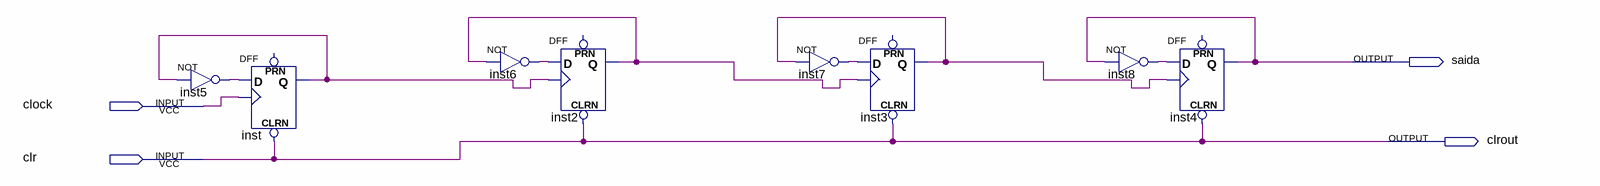
[diagram p0: schematic sheet]
// Quartus schematic flipflopd.bdf as structural Verilog: 8 symbols, 4 pins
module flipflopd (
  input  clock,
  input  clr,
  output saida,
  output clrout
);

  wire inst2_q, inst3_q, inst5_out, inst6_out, inst7_out, inst8_out, inst_q;

  not inst5 (inst5_out, inst_q);
  DFF inst (.CLRN(clr), .CLK(clock), .D(inst5_out), .Q(inst_q));  // open: PRN
  not inst6 (inst6_out, inst2_q);
  DFF inst2 (.CLRN(clr), .CLK(inst_q), .D(inst6_out), .Q(inst2_q));  // open: PRN
  not inst7 (inst7_out, inst3_q);
  DFF inst3 (.CLRN(clr), .CLK(inst2_q), .D(inst7_out), .Q(inst3_q));  // open: PRN
  DFF inst4 (.CLRN(clr), .CLK(inst3_q), .D(inst8_out), .Q(saida));  // open: PRN
  not inst8 (inst8_out, saida);

  assign clrout = clr;
endmodule
